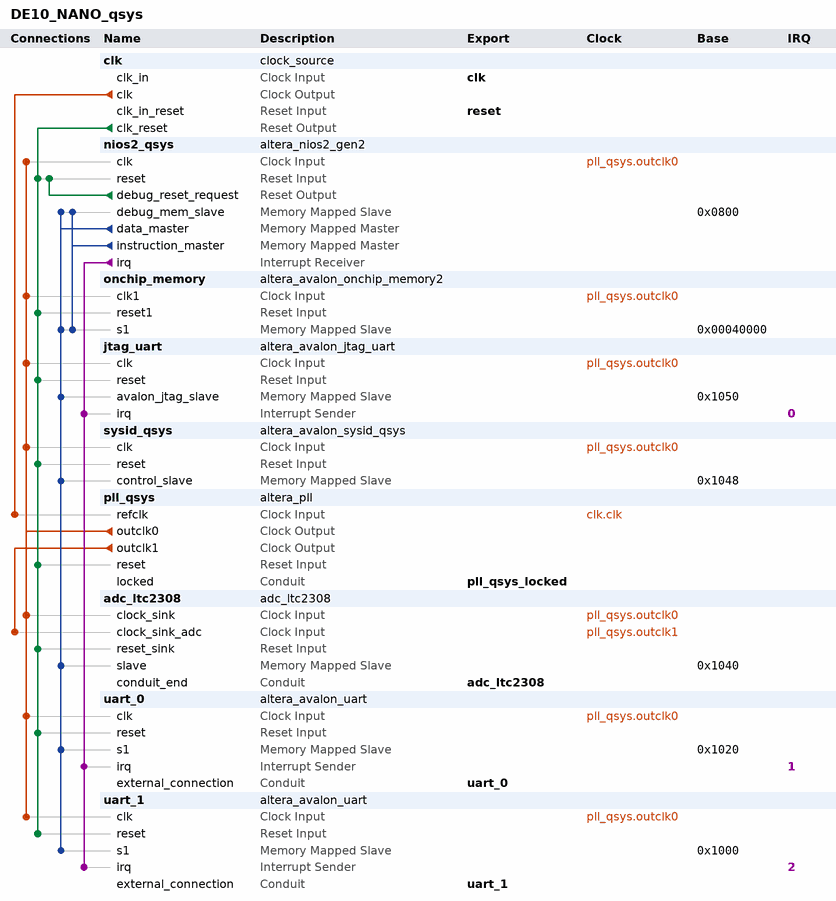
[diagram p0: system contents]
# Platform Designer (Qsys) system DE10_NANO_qsys, Cyclone V 5CSEBA6U23I7
# Parameters at their usual value, and those the tool derives, are not listed.
package require -exact qsys 15.0
create_system DE10_NANO_qsys
set_project_property DEVICE_FAMILY {Cyclone V}
set_project_property DEVICE 5CSEBA6U23I7

add_instance clk clock_source 15.0
set_instance_parameter_value clk clockFrequency 50000000

add_instance nios2_qsys altera_nios2_gen2 15.0
set_instance_parameter_value nios2_qsys dcache_size 2048
set_instance_parameter_value nios2_qsys dividerType srt2
set_instance_parameter_value nios2_qsys exceptionSlave onchip_memory.s1
set_instance_parameter_value nios2_qsys icache_size 4096
set_instance_parameter_value nios2_qsys impl Fast
set_instance_parameter_value nios2_qsys resetSlave onchip_memory.s1
set_instance_parameter_value nios2_qsys setting_activateTrace true

add_instance onchip_memory altera_avalon_onchip_memory2 15.0
set_instance_parameter_value onchip_memory dataWidth 32
set_instance_parameter_value onchip_memory dualPort false
set_instance_parameter_value onchip_memory initMemContent true
set_instance_parameter_value onchip_memory initializationFileName "D:\\Ruanjian\\Quartus15.0\\Test\\Shouyu\\Sign_G\\qsys\\software\\memory_init\\Sign_G_qsys_onchip_memory.hex"
set_instance_parameter_value onchip_memory memorySize 160000
set_instance_parameter_value onchip_memory useNonDefaultInitFile true

add_instance jtag_uart altera_avalon_jtag_uart 15.0
set_instance_parameter_value jtag_uart simInteractiveOptions NO_INTERACTIVE_WINDOWS

add_instance sysid_qsys altera_avalon_sysid_qsys 15.0
set_instance_parameter_value sysid_qsys id 0

add_instance pll_qsys altera_pll 15.0
set_instance_parameter_value pll_qsys gui_device_speed_grade 1
set_instance_parameter_value pll_qsys gui_number_of_clocks 2
set_instance_parameter_value pll_qsys gui_operation_mode normal
set_instance_parameter_value pll_qsys gui_output_clock_frequency0 100.0
set_instance_parameter_value pll_qsys gui_output_clock_frequency1 40.0
set_instance_parameter_value pll_qsys gui_pll_mode {Integer-N PLL}
set_instance_parameter_value pll_qsys gui_reference_clock_frequency 50.0
set_instance_parameter_value pll_qsys gui_use_locked true

add_instance adc_ltc2308 adc_ltc2308 1.1

add_instance uart_0 altera_avalon_uart 15.0
set_instance_parameter_value uart_0 baud 115200
set_instance_parameter_value uart_0 dataBits 8
set_instance_parameter_value uart_0 fixedBaud true
set_instance_parameter_value uart_0 parity NONE
set_instance_parameter_value uart_0 stopBits 1

add_instance uart_1 altera_avalon_uart 15.0
set_instance_parameter_value uart_1 baud 9600
set_instance_parameter_value uart_1 dataBits 8
set_instance_parameter_value uart_1 fixedBaud true
set_instance_parameter_value uart_1 parity NONE
set_instance_parameter_value uart_1 stopBits 1

# connections
add_connection clk.clk pll_qsys.refclk clock
add_connection pll_qsys.outclk0 adc_ltc2308.clock_sink clock
add_connection pll_qsys.outclk0 jtag_uart.clk clock
add_connection pll_qsys.outclk0 nios2_qsys.clk clock
add_connection pll_qsys.outclk0 onchip_memory.clk1 clock
add_connection pll_qsys.outclk0 sysid_qsys.clk clock
add_connection pll_qsys.outclk0 uart_0.clk clock
add_connection pll_qsys.outclk0 uart_1.clk clock
add_connection pll_qsys.outclk1 adc_ltc2308.clock_sink_adc clock
add_connection clk.clk_reset adc_ltc2308.reset_sink reset
add_connection clk.clk_reset jtag_uart.reset reset
add_connection clk.clk_reset nios2_qsys.reset reset
add_connection clk.clk_reset onchip_memory.reset1 reset
add_connection clk.clk_reset pll_qsys.reset reset
add_connection clk.clk_reset sysid_qsys.reset reset
add_connection clk.clk_reset uart_0.reset reset
add_connection clk.clk_reset uart_1.reset reset
add_connection nios2_qsys.debug_reset_request nios2_qsys.reset reset
add_connection nios2_qsys.data_master adc_ltc2308.slave avalon
set_connection_parameter_value nios2_qsys.data_master/adc_ltc2308.slave baseAddress 0x1040
add_connection nios2_qsys.data_master jtag_uart.avalon_jtag_slave avalon
set_connection_parameter_value nios2_qsys.data_master/jtag_uart.avalon_jtag_slave baseAddress 0x1050
add_connection nios2_qsys.data_master nios2_qsys.debug_mem_slave avalon
set_connection_parameter_value nios2_qsys.data_master/nios2_qsys.debug_mem_slave baseAddress 0x0800
add_connection nios2_qsys.data_master onchip_memory.s1 avalon
set_connection_parameter_value nios2_qsys.data_master/onchip_memory.s1 baseAddress 0x00040000
add_connection nios2_qsys.data_master sysid_qsys.control_slave avalon
set_connection_parameter_value nios2_qsys.data_master/sysid_qsys.control_slave baseAddress 0x1048
add_connection nios2_qsys.data_master uart_0.s1 avalon
set_connection_parameter_value nios2_qsys.data_master/uart_0.s1 baseAddress 0x1020
add_connection nios2_qsys.data_master uart_1.s1 avalon
set_connection_parameter_value nios2_qsys.data_master/uart_1.s1 baseAddress 0x1000
add_connection nios2_qsys.instruction_master nios2_qsys.debug_mem_slave avalon
set_connection_parameter_value nios2_qsys.instruction_master/nios2_qsys.debug_mem_slave baseAddress 0x0800
add_connection nios2_qsys.instruction_master onchip_memory.s1 avalon
set_connection_parameter_value nios2_qsys.instruction_master/onchip_memory.s1 baseAddress 0x00040000
add_connection nios2_qsys.irq jtag_uart.irq interrupt
set_connection_parameter_value nios2_qsys.irq/jtag_uart.irq irqNumber 0
add_connection nios2_qsys.irq uart_0.irq interrupt
set_connection_parameter_value nios2_qsys.irq/uart_0.irq irqNumber 1
add_connection nios2_qsys.irq uart_1.irq interrupt
set_connection_parameter_value nios2_qsys.irq/uart_1.irq irqNumber 2

# exported interfaces
add_interface adc_ltc2308 conduit end
set_interface_property adc_ltc2308 EXPORT_OF adc_ltc2308.conduit_end
add_interface clk clock sink
set_interface_property clk EXPORT_OF clk.clk_in
add_interface pll_qsys_locked conduit end
set_interface_property pll_qsys_locked EXPORT_OF pll_qsys.locked
add_interface reset reset sink
set_interface_property reset EXPORT_OF clk.clk_in_reset
add_interface uart_0 conduit end
set_interface_property uart_0 EXPORT_OF uart_0.external_connection
add_interface uart_1 conduit end
set_interface_property uart_1 EXPORT_OF uart_1.external_connection

set_interconnect_requirement {$system} qsys_mm.clockCrossingAdapter HANDSHAKE
set_interconnect_requirement {$system} qsys_mm.enableEccProtection FALSE
set_interconnect_requirement {$system} qsys_mm.insertDefaultSlave FALSE
set_interconnect_requirement {$system} qsys_mm.maxAdditionalLatency 1

save_system DE10_NANO_qsys.qsys
